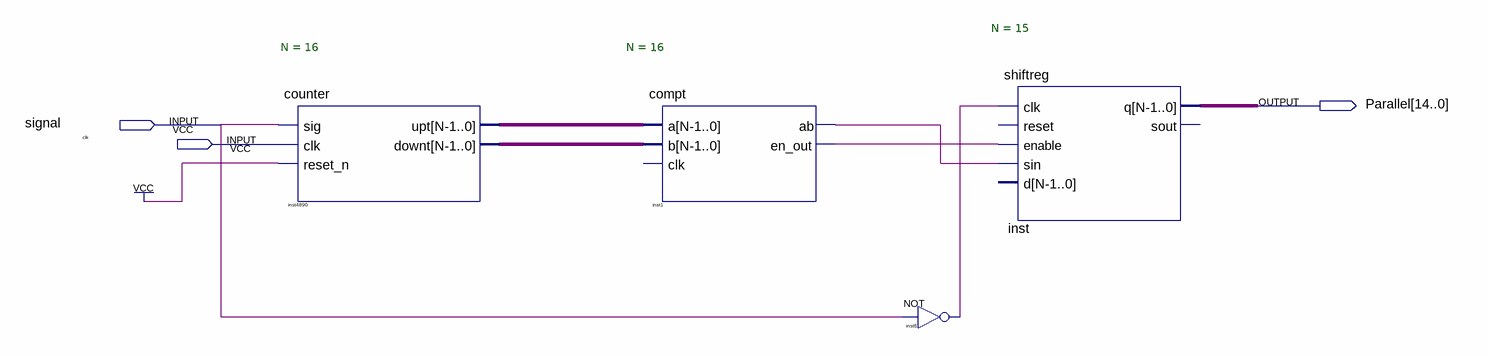
[diagram p0: schematic sheet]
// Quartus schematic TOP.bdf as structural Verilog: 4 symbols, 3 pins
module TOP (
  input  signal,
  input  clk,
  output [14:0] Parallel
);

  wire inst1_ab, inst1_en_out, inst6_out;
  wire [15:0] inst4890_downt, inst4890_upt;

  counter #(.N(16)) inst4890 (.sig(signal), .clk(clk), .reset_n(1'b1), .upt(inst4890_upt), .downt(inst4890_downt));
  compt #(.N(16)) inst1 (.a(inst4890_upt), .b(inst4890_downt), .ab(inst1_ab), .en_out(inst1_en_out));  // open: clk
  not inst6 (inst6_out, signal);
  shiftreg #(.N(15)) inst (
    .clk(inst6_out), .enable(inst1_en_out), .sin(inst1_ab), .q(Parallel));  // open: reset, d, sout
endmodule
